# EAGLE schematic badge_2013 (EAGLE 6.4)

## Sheet 1 of 2
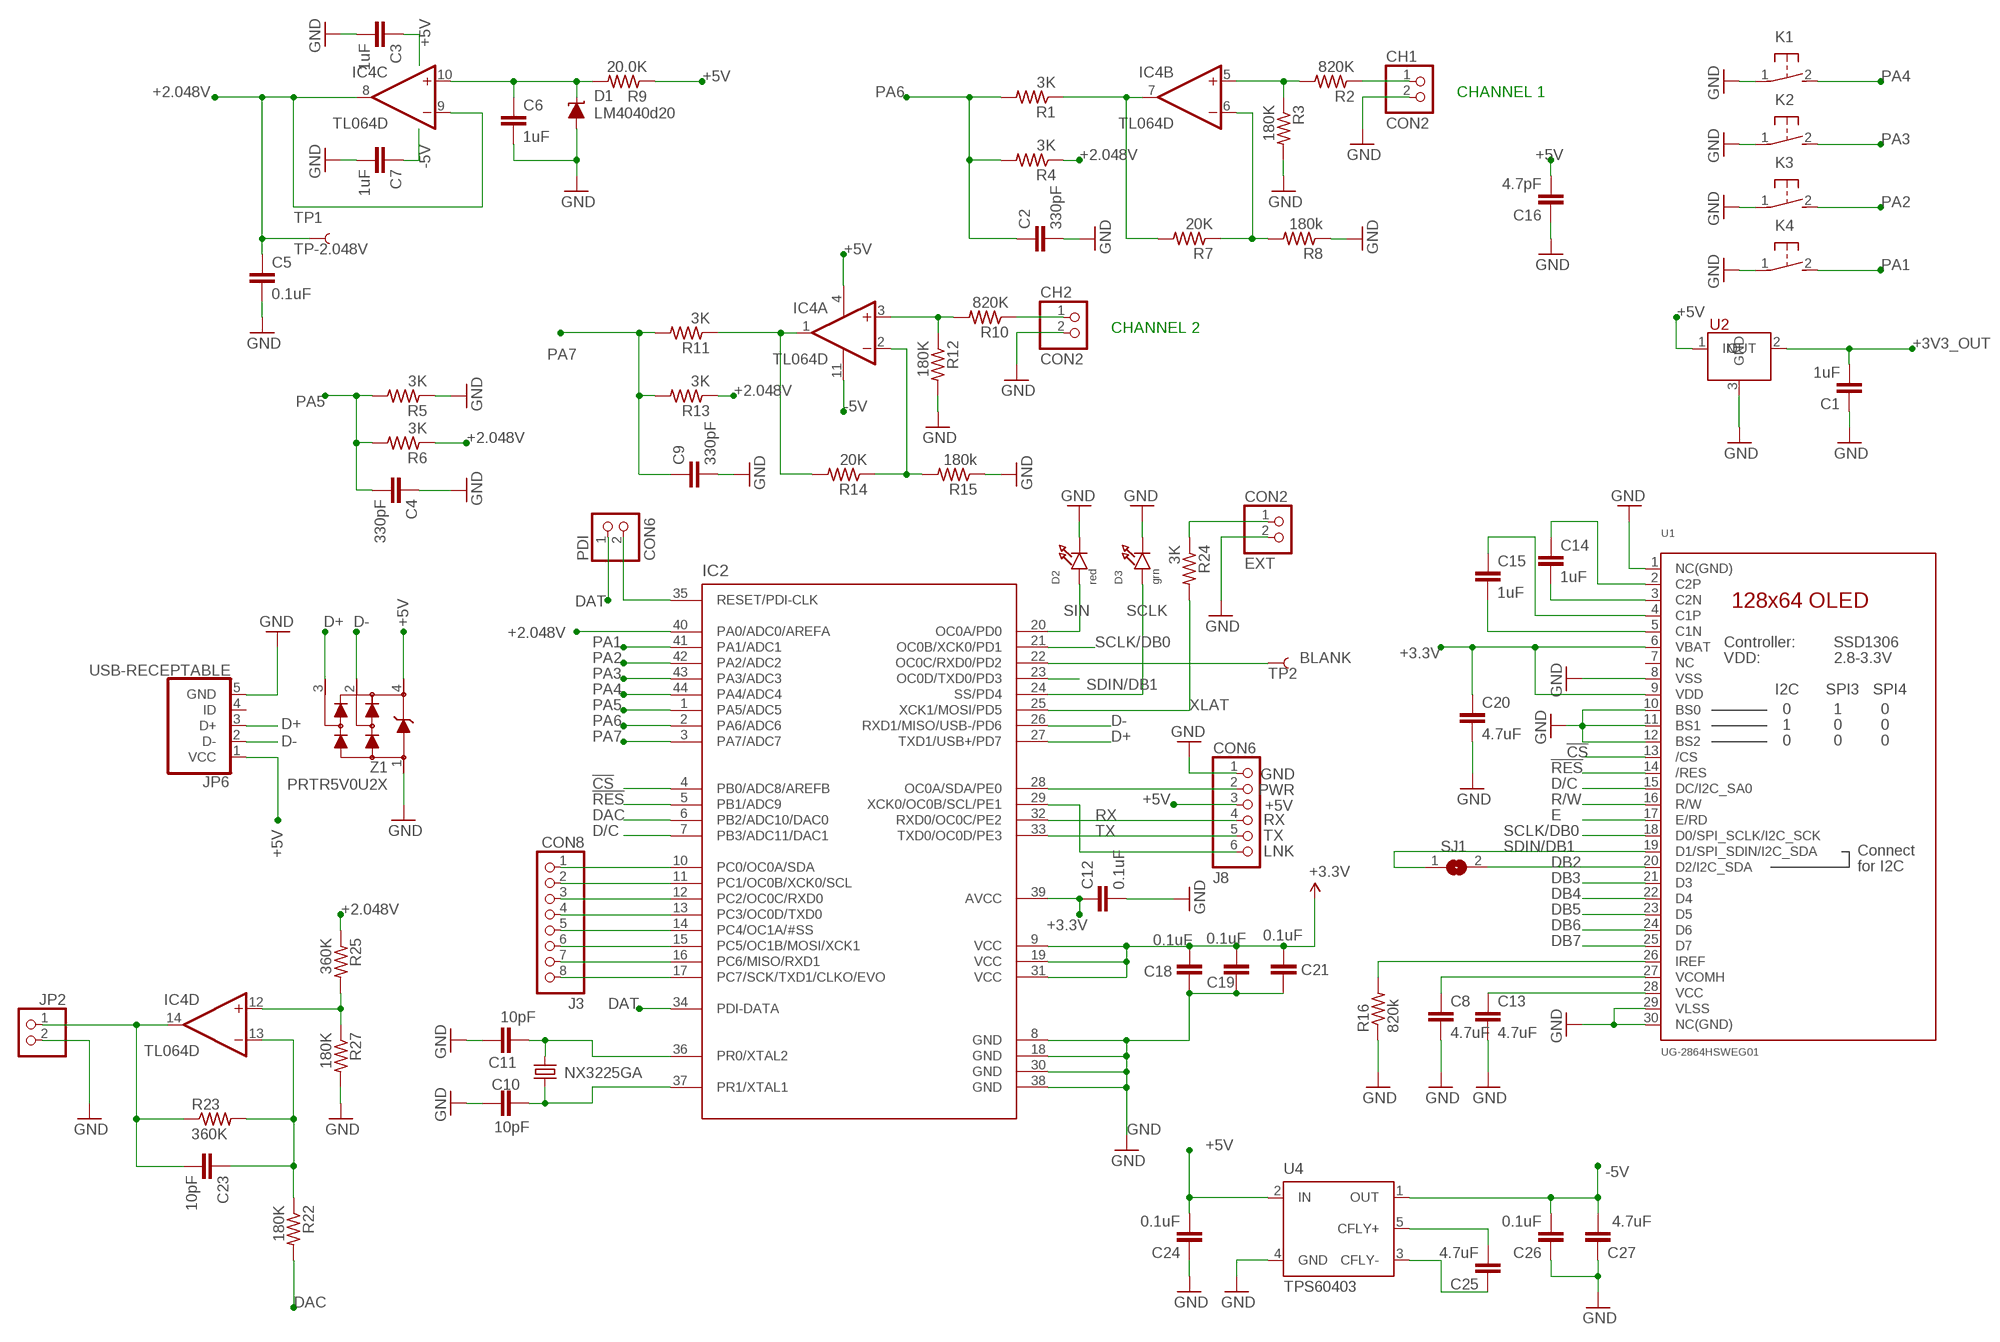
[diagram p0: schematic, sheet 1]

### Parts
C1  1uF  CAP0805  [0805]
C2  330pF  CAP0805  [0805]
C3  1uF  CAP0805  [0805]
C4  330pF  CAP0805  [0805]
C5  0.1uF  CAP0805  [0805]
C6  1uF  CAP0805  [0805]
C7  1uF  CAP0805  [0805]
C8  4.7uF  CAP0805  [0805]
C9  330pF  CAP0805  [0805]
C10  10pF  CAP0805  [0805]
C11  10pF  CAP0805  [0805]
C12  0.1uF  CAP0805  [0805]
C13  4.7uF  CAP0805  [0805]
C14  1uF  CAP0805  [0805]
C15  1uF  CAP0805  [0805]
C16  4.7pF  CAP0805  [0805]
C18  0.1uF  CAP0805  [0805]
C19  0.1uF  CAP0805  [0805]
C20  4.7uF  CAP0805  [0805]
C21  0.1uF  CAP0805  [0805]
C23  10pF  CAP0805  [0805]
C24  0.1uF  CAP0805  [0805]
C25  4.7uF  CAP0805  [0805]
C26  0.1uF  CAP0805  [0805]
C27  4.7uF  CAP0805  [0805]
CH1  CON2  HEADER-1X2  [1X02_OVAL]
CH2  CON2  HEADER-1X2  [1X02_OVAL]
CON2  EXT  HEADER-1X2  [1X02_OVAL]
CON6  J8  HEADER-1X6  [1X06_OVAL]
CON8  J3  HEADER-1X8  [1X08_OVAL]
D1  LM4040d20  LM4041D12DBZ  [DBZ_R-PDSO-G3]
D2  red  LED0805  [CHIPLED_0805]
D3  grn  LED0805  [CHIPLED_0805]
IC2  NONOLITH_ATXMEGAXXA4U-AU  [NONOLITH_TQFP-44]
IC4  TL064D  [SO14]
JP2  HEADER-1X2  [1X02_OVAL]
JP6  USB-RECEPTABLE  [FCI-10103594-0001LF]
K1  5-XX  [B3F-5XX]
K2  5-XX  [B3F-5XX]
K3  5-XX  [B3F-5XX]
K4  5-XX  [B3F-5XX]
PDI  CON6  HEADER-1X2  [1X02_OVAL]
R1  3K  R-US_R0805  [R0805]
R2  820K  R-US_R0805  [R0805]
R3  180K  R-US_R0805  [R0805]
R4  3K  R-US_R0805  [R0805]
R5  3K  R-US_R0805  [R0805]
R6  3K  R-US_R0805  [R0805]
R7  20K  R-US_R0805  [R0805]
R8  180k  R-US_R0805  [R0805]
R9  20.0K  R-US_R0805  [R0805]
R10  820K  R-US_R0805  [R0805]
R11  3K  R-US_R0805  [R0805]
R12  180K  R-US_R0805  [R0805]
R13  3K  R-US_R0805  [R0805]
R14  20K  R-US_R0805  [R0805]
R15  180k  R-US_R0805  [R0805]
R16  820k  R-US_R0805  [R0805]
R22  180K  R-US_R0805  [R0805]
R23  360K  R-US_R0805  [R0805]
R24  3K  R-US_R0805  [R0805]
R25  360K  R-US_R0805  [R0805]
R27  180K  R-US_R0805  [R0805]
SJ1  SOLDERJUMPERREFLOW  [SOLDERJUMPER_REFLOW]
TP1  TP-2.048V  TEST-POINT2  [PAD.02X.02]
TP2  TEST-POINT2  [PAD.02X.02]
U1  UG-2864HSWEG01  MICROBUILDER_DISP_OLED_UG-2864HSWEG010.96"  [MICROBUILDER_UG-2864HSWEG01_0.96IN_WRAPAROUND]
U2  AP7333-33SOT23-3  [SOT23-3]
U4  TPS60403  [SOT-23-5]
X2  NX3225GA  [NX3225GA]
Z1  PRTR5V0U2X  [SOT143B]

### Nets
!CS: IC2.4(PB0/ADC8/AREFB) U1.13(/CS)
!RES: IC2.5(PB1/ADC9) U1.14(/RES)
+2.048V: C5.1 IC2.40(PA0/ADC0/AREFA) IC4.8(C:OUT) IC4.9(C:-IN) R4.1 R6.1 R13.1 R25.1 TP1.P$1
+3.3V: C12.1 C18.2 C19.2 C20.1 C21.2 IC2.9(VCC) IC2.19(VCC) IC2.31(VCC) IC2.39(AVCC) U1.6(VBAT) U1.9(VDD) ; also sheet 2
+3V3_OUT: C1.2 U2.2(OUT) ; also sheet 2
+5V: C3.1 C16.2 C24.2 CON6.3 IC4.4(P:V+) JP6.1(VCC) R9.1 U2.1(IN) U4.2(IN) Z1.4
-5V: C7.1 C26.2 C27.2 IC4.11(P:V-) U4.1(OUT)
BLANK: IC2.22(OC0C/RXD0/PD2) TP2.P$1 ; also sheet 2
D+: IC2.27(TXD1/USB+/PD7) JP6.3(D+) Z1.3
D-: IC2.26(RXD1/MISO/USB-/PD6) JP6.2(D-) Z1.2
D/C: IC2.7(PB3/ADC11/DAC1) U1.15(DC/I2C_SA0)
DAC: IC2.6(PB2/ADC10/DAC0) R22.2
DAT: IC2.34(PDI-DATA) PDI.1
DB2: SJ1.2 U1.20(D2/I2C_SDA)
DB3: U1.21(D3)
DB4: U1.22(D4)
DB5: U1.23(D5)
DB6: U1.24(D6)
DB7: U1.25(D7)
E: U1.17(E/RD)
GND: C1.1 C2.2 C3.2 C4.1 C5.2 C6.2 C7.2 C8.2 C9.2 C10.1 C11.1 C12.2 C13.2 C16.1 C18.1 C19.1 C20.2 C21.1 C24.1 C26.1 C27.1 CH1.2 CH2.2 CON2.2 CON6.1 D1.2(A) D2.C D3.C IC2.8(GND) IC2.18(GND) IC2.30(GND) IC2.38(GND) JP2.2 JP6.5(GND) K1.1(P) K2.1(P) K3.1(P) K4.1(P) R3.2 R5.1 R8.1 R12.2 R15.1 R16.1 R27.2 U1.1(NC(GND)) U1.8(VSS) U1.10(BS0) U1.11(BS1) U1.12(BS2) U1.29(VLSS) U1.30(NC(GND)) U2.3(GND) U4.4(GND) Z1.1 ; also sheet 2
J3: CON8.5 IC2.14(PC4/OC1A/#SS)
LNK: CON6.6 IC2.29(XCK0/OC0B/SCL/PE1)
N$2: C14.1 U1.2(C2P)
N$3: C14.2 U1.3(C2N)
N$4: C15.1 U1.4(C1P)
N$5: C15.2 U1.5(C1N)
N$6: CON2.1 R24.1
N$7: C23.2 IC4.14(D:OUT) JP2.1 R23.1
N$8: C25.2 U4.5(CFLY+)
N$9: C25.1 U4.3(CFLY-)
N$10: CON8.1 IC2.10(PC0/OC0A/SDA)
N$11: CON8.2 IC2.11(PC1/OC0B/XCK0/SCL)
N$12: CON8.3 IC2.12(PC2/OC0C/RXD0)
N$14: CON8.4 IC2.13(PC3/OC0D/TXD0)
N$16: CON8.6 IC2.15(PC5/OC1B/MOSI/XCK1)
N$17: CON8.7 IC2.16(PC6/MISO/RXD1)
N$18: CON8.8 IC2.17(PC7/SCK/TXD1/CLKO/EVO)
N$20: IC4.12(D:+IN) R25.2 R27.1
N$23: C6.1 D1.1(C) IC4.10(C:+IN) R9.2
N$24: C23.1 IC4.13(D:-IN) R22.1 R23.2
N$25: IC4.5(B:+IN) R2.2 R3.1
N$26: CH1.1 R2.1
N$27: IC4.3(A:+IN) R10.2 R12.1
N$28: IC4.6(B:-IN) R7.1 R8.2
N$29: IC4.7(B:OUT) R1.1 R7.2
N$30: CH2.1 R10.1
N$31: IC4.2(A:-IN) R14.1 R15.2
N$32: R16.2 U1.26(IREF)
N$33: C8.1 U1.27(VCOMH)
N$34: C13.1 U1.28(VCC)
N$35: IC4.1(A:OUT) R11.1 R14.2
N$36: C11.2 IC2.36(PR0/XTAL2) X2.3
N$37: C10.2 IC2.37(PR1/XTAL1) X2.1
N$38: IC2.35(RESET/PDI-CLK) PDI.2
PA1: IC2.41(PA1/ADC1) K4.2(S)
PA2: IC2.42(PA2/ADC2) K3.2(S)
PA3: IC2.43(PA3/ADC3) K2.2(S)
PA4: IC2.44(PA4/ADC4) K1.2(S)
PA5: C4.2 IC2.1(PA5/ADC5) R5.2 R6.2
PA6: C2.1 IC2.2(PA6/ADC6) R1.2 R4.2
PA7: C9.1 IC2.3(PA7/ADC7) R11.2 R13.2
PWR: CON6.2 IC2.28(OC0A/SDA/PE0)
R/W: U1.16(R/W)
RX: CON6.4 IC2.32(RXD0/OC0C/PE2)
SCLK: D3.A IC2.24(SS/PD4) ; also sheet 2
SCLK/DB0: IC2.21(OC0B/XCK0/PD1) U1.18(D0/SPI_SCLK/I2C_SCK)
SDIN/DB1: IC2.23(OC0D/TXD0/PD3) SJ1.1 U1.19(D1/SPI_SDIN/I2C_SDA)
SIN: D2.A IC2.20(OC0A/PD0) ; also sheet 2
TX: CON6.5 IC2.33(TXD0/OC0D/PE3)
XLAT: IC2.25(XCK1/MOSI/PD5) R24.2 ; also sheet 2
Unconnected: JP6.4(ID) U1.7(NC)

### Notes on the sheet
- CHANNEL 1
- CHANNEL 2

## Sheet 2 of 2
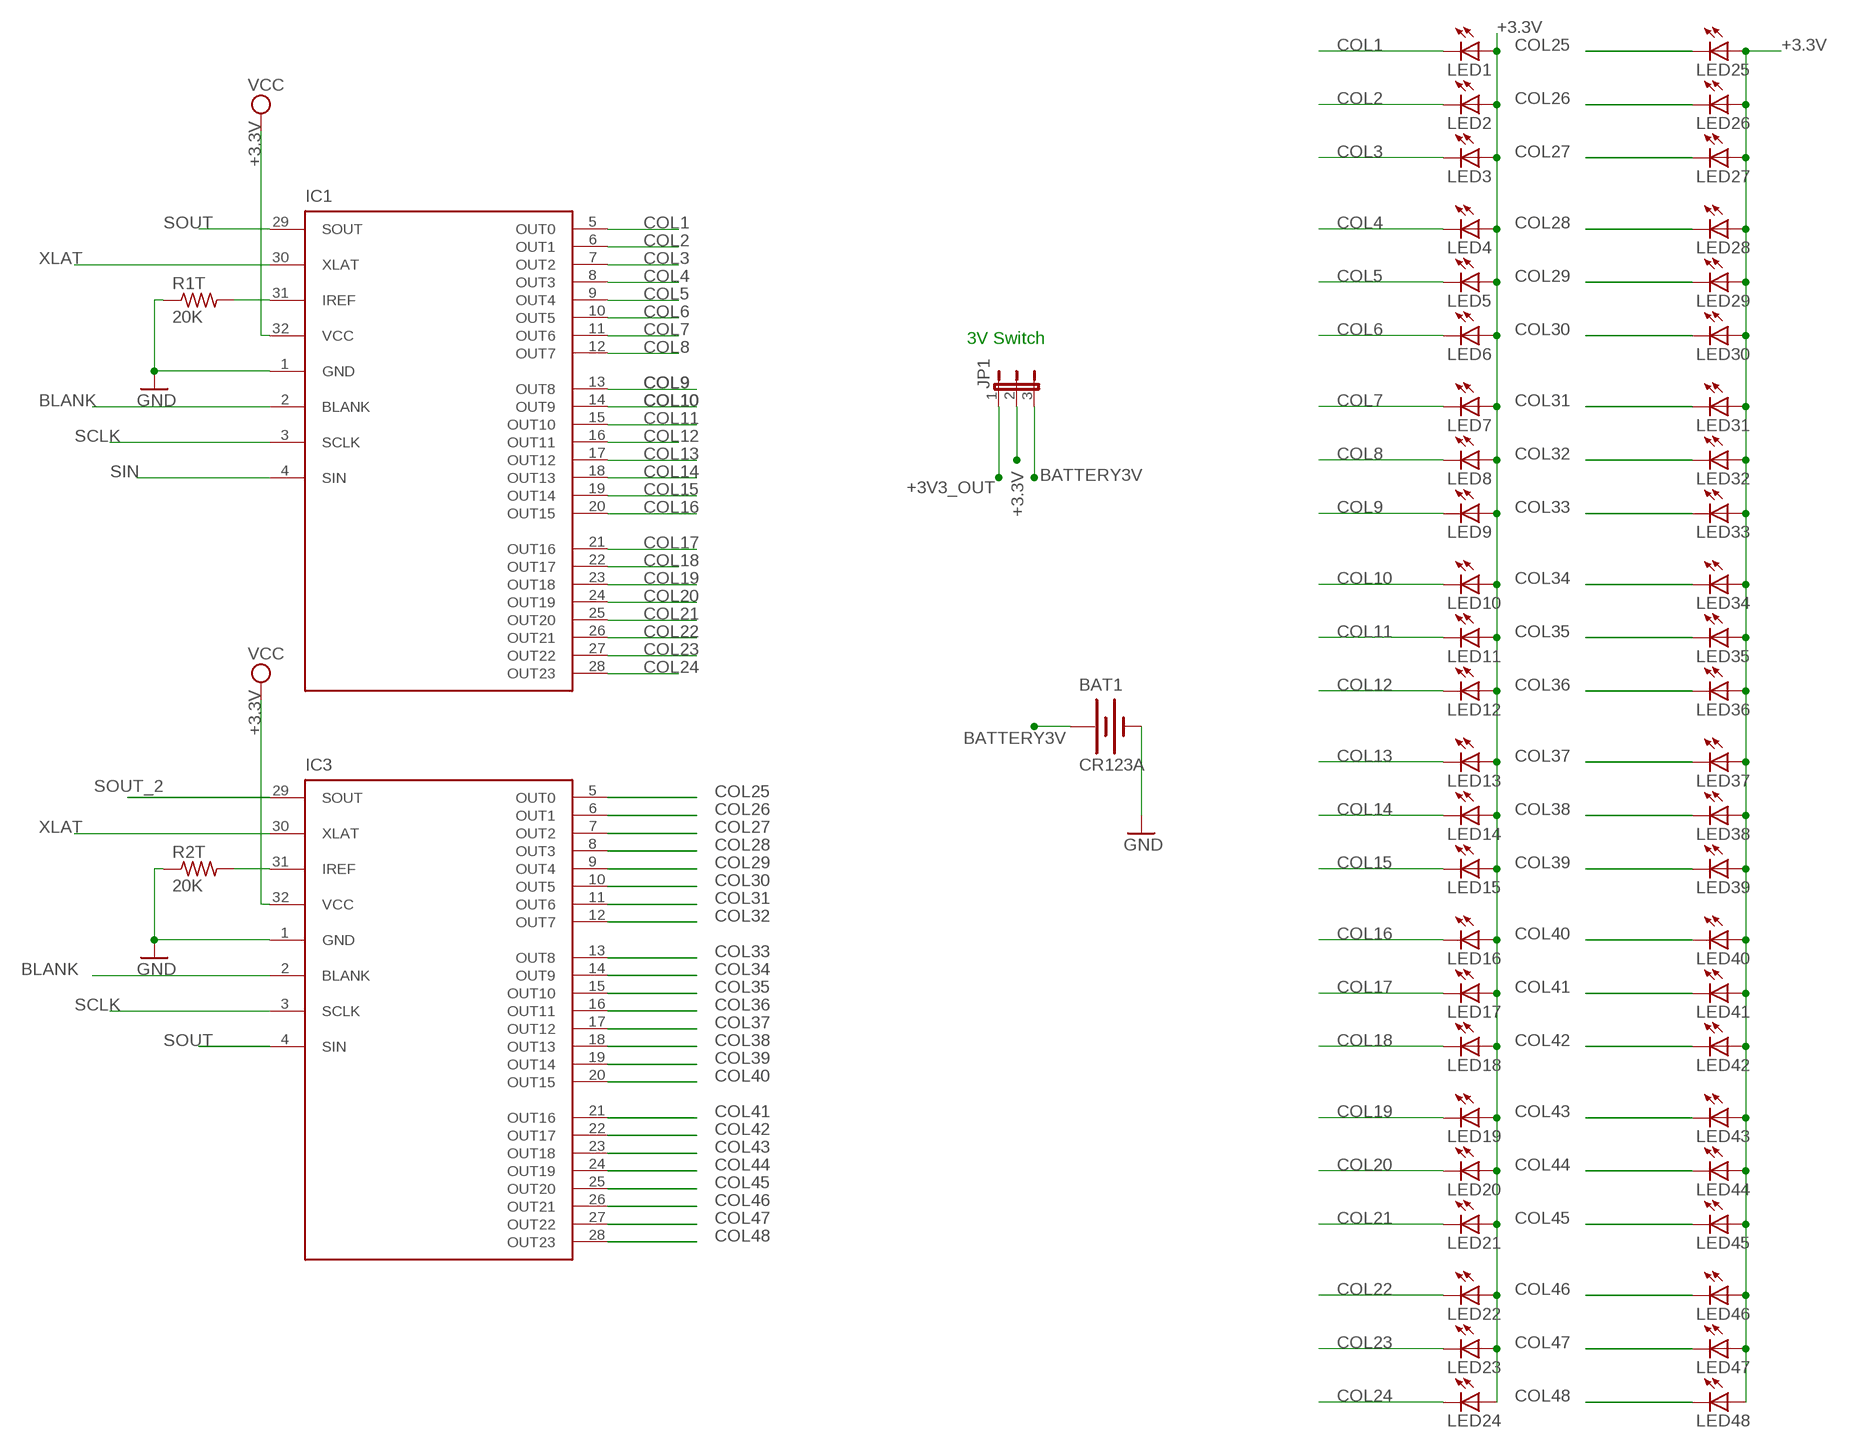
[diagram p1: schematic, sheet 2]

### Parts
BAT1  CR123A  BATTERYCR123A  [BATTERY_CR123A]
IC1  SLICE_NOSHIFT_TLC5947HTSSOP32DAP  [HTSSOP32DAP]
IC3  SLICE_NOSHIFT_TLC5947HTSSOP32DAP  [HTSSOP32DAP]
JP1  JUMPER3  [JUMPER3]
LED1  LED3MM  [LED3MM]
LED2  LED3MM  [LED3MM]
LED3  LED3MM  [LED3MM]
LED4  LED3MM  [LED3MM]
LED5  LED3MM  [LED3MM]
LED6  LED3MM  [LED3MM]
LED7  LED3MM  [LED3MM]
LED8  LED3MM  [LED3MM]
LED9  LED3MM  [LED3MM]
LED10  LED3MM  [LED3MM]
LED11  LED3MM  [LED3MM]
LED12  LED3MM  [LED3MM]
LED13  LED3MM  [LED3MM]
LED14  LED3MM  [LED3MM]
LED15  LED3MM  [LED3MM]
LED16  LED3MM  [LED3MM]
LED17  LED3MM  [LED3MM]
LED18  LED3MM  [LED3MM]
LED19  LED3MM  [LED3MM]
LED20  LED3MM  [LED3MM]
LED21  LED3MM  [LED3MM]
LED22  LED3MM  [LED3MM]
LED23  LED3MM  [LED3MM]
LED24  LED3MM  [LED3MM]
LED25  LED3MM  [LED3MM]
LED26  LED3MM  [LED3MM]
LED27  LED3MM  [LED3MM]
LED28  LED3MM  [LED3MM]
LED29  LED3MM  [LED3MM]
LED30  LED3MM  [LED3MM]
LED31  LED3MM  [LED3MM]
LED32  LED3MM  [LED3MM]
LED33  LED3MM  [LED3MM]
LED34  LED3MM  [LED3MM]
LED35  LED3MM  [LED3MM]
LED36  LED3MM  [LED3MM]
LED37  LED3MM  [LED3MM]
LED38  LED3MM  [LED3MM]
LED39  LED3MM  [LED3MM]
LED40  LED3MM  [LED3MM]
LED41  LED3MM  [LED3MM]
LED42  LED3MM  [LED3MM]
LED43  LED3MM  [LED3MM]
LED44  LED3MM  [LED3MM]
LED45  LED3MM  [LED3MM]
LED46  LED3MM  [LED3MM]
LED47  LED3MM  [LED3MM]
LED48  LED3MM  [LED3MM]
R1T  20K  R-US_R0805  [R0805]
R2T  20K  R-US_R0805  [R0805]

### Nets
+3.3V: IC1.32(VCC) IC3.32(VCC) JP1.2 LED1.A LED2.A LED3.A LED4.A LED5.A LED6.A LED7.A LED8.A LED9.A LED10.A LED11.A LED12.A LED13.A LED14.A LED15.A LED16.A LED17.A LED18.A LED19.A LED20.A LED21.A LED22.A LED23.A LED24.A LED25.A LED26.A LED27.A LED28.A LED29.A LED30.A LED31.A LED32.A LED33.A LED34.A LED35.A LED36.A LED37.A LED38.A LED39.A LED40.A LED41.A LED42.A LED43.A LED44.A LED45.A LED46.A LED47.A LED48.A ; supply symbol labelled VCC ; also sheet 1
+3V3_OUT: JP1.1 ; also sheet 1
BATTERY3V: BAT1.+ JP1.3
BLANK: IC1.2(BLANK) IC3.2(BLANK) ; also sheet 1
COL1: IC1.5(OUT0) LED1.K(C)
COL2: IC1.6(OUT1) LED2.K(C)
COL3: IC1.7(OUT2) LED3.K(C)
COL4: IC1.8(OUT3) LED4.K(C)
COL5: IC1.9(OUT4) LED5.K(C)
COL6: IC1.10(OUT5) LED6.K(C)
COL7: IC1.11(OUT6) LED7.K(C)
COL8: IC1.12(OUT7) LED8.K(C)
COL9: IC1.13(OUT8) LED9.K(C)
COL10: IC1.14(OUT9) LED10.K(C)
COL11: IC1.15(OUT10) LED11.K(C)
COL12: IC1.16(OUT11) LED12.K(C)
COL13: IC1.17(OUT12) LED13.K(C)
COL14: IC1.18(OUT13) LED14.K(C)
COL15: IC1.19(OUT14) LED15.K(C)
COL16: IC1.20(OUT15) LED16.K(C)
COL17: IC1.21(OUT16) LED17.K(C)
COL18: IC1.22(OUT17) LED18.K(C)
COL19: IC1.23(OUT18) LED19.K(C)
COL20: IC1.24(OUT19) LED20.K(C)
COL21: IC1.25(OUT20) LED21.K(C)
COL22: IC1.26(OUT21) LED22.K(C)
COL23: IC1.27(OUT22) LED23.K(C)
COL24: IC1.28(OUT23) LED24.K(C)
COL25: IC3.5(OUT0) LED25.K(C)
COL26: IC3.6(OUT1) LED26.K(C)
COL27: IC3.7(OUT2) LED27.K(C)
COL28: IC3.8(OUT3) LED28.K(C)
COL29: IC3.9(OUT4) LED29.K(C)
COL30: IC3.10(OUT5) LED30.K(C)
COL31: IC3.11(OUT6) LED31.K(C)
COL32: IC3.12(OUT7) LED32.K(C)
COL33: IC3.13(OUT8) LED33.K(C)
COL34: IC3.14(OUT9) LED34.K(C)
COL35: IC3.15(OUT10) LED35.K(C)
COL36: IC3.16(OUT11) LED36.K(C)
COL37: IC3.17(OUT12) LED37.K(C)
COL38: IC3.18(OUT13) LED38.K(C)
COL39: IC3.19(OUT14) LED39.K(C)
COL40: IC3.20(OUT15) LED40.K(C)
COL41: IC3.21(OUT16) LED41.K(C)
COL42: IC3.22(OUT17) LED42.K(C)
COL43: IC3.23(OUT18) LED43.K(C)
COL44: IC3.24(OUT19) LED44.K(C)
COL45: IC3.25(OUT20) LED45.K(C)
COL46: IC3.26(OUT21) LED46.K(C)
COL47: IC3.27(OUT22) LED47.K(C)
COL48: IC3.28(OUT23) LED48.K(C)
GND: BAT1.- IC1.1(GND) IC3.1(GND) R1T.1 R2T.1 ; also sheet 1
N$1: IC3.31(IREF) R2T.2
N$13: IC1.31(IREF) R1T.2
SCLK: IC1.3(SCLK) IC3.3(SCLK) ; also sheet 1
SIN: IC1.4(SIN) ; also sheet 1
SOUT: IC1.29(SOUT) IC3.4(SIN)
SOUT_2: IC3.29(SOUT)
XLAT: IC1.30(XLAT) IC3.30(XLAT) ; also sheet 1

### Notes on the sheet
- 3V Switch

## Power pins joined to a net without a drawn wire
DGND: X2.2(DGND) X2.4(DGND)

## Library data of the parts
BAT1 = tvbgone-adj:BATTERY: Battery Holders Various common sizes : AA, AAA, 20mm coin cell and 12mm coin cell.
C1-C16 C18-C21 C23-C27 = SparkFun:CAP: Capacitor Standard 0603 ceramic capacitor, and 0.1" leaded capacitor.
CH1 CH2 CON2 JP2 PDI = microbuilder:HEADER-1X2: PIN HEADER
CON6 = microbuilder:HEADER-1X6: PIN HEADER
CON8 = microbuilder:HEADER-1X8: PIN HEADER
D1 = texas:LM4041: PRECISION MICROPOWER SHUNT VOLTAGE REFERENCE Source: http://focus.ti.com/lit/ds/slcs146e/slcs146e.pdf; MF: TEXAS INSTRUMENT CONNECTORS; MPN: LM4041D12QDBZT; OC_FARNELL: 1755118; OC_NEWARK: 43K3381
D2 D3 = microbuilder:LED: LED
IC1 IC3 = 23b_clock_noleds:SLICE_NOSHIFT_TLC5947
IC2 = Outline:NONOLITH_ATXMEGAXXA4U: ATXMEGA A4U Series (XMEGA+USB)
IC4 = linear:TL064: OP AMP
JP1 = microbuilder:JUMPER3: JUMPER - 3 Pins
JP6 = daspilker:USB-RECEPTABLE: USB Receptable
K1-K4 = switch-omron:5-XX
LED1-LED48 = led:LED: LED
R1-R16 R22-R25 R27 = resistor:R-US_: RESISTOR, American symbol
R1T R2T = rcl:R-US_: RESISTOR, American symbol
SJ1 = microbuilder:SOLDERJUMPER: SMD Solder JUMPER Solder the two pads together to create a connection, or remove the solder to break it. REFLOW - Use this footprint for solder paste and reflow ovens. WAVE - Use this footprint for hand-soldering (larger pads).
TP1 TP2 = SparkFun:TEST-POINT
U1 = badge.lbrbadge_2013:MICROBUILDER_DISP_OLED_UG-2864HSWEG01: UG-2864HSWEG01 OLED display Both 1.3" and 0.96" models share the same FPC tab footprint, only the screen dimensions vary.
U2 = SparkFun:AP7333-33: AP7333-33 300mA, Low Quiescent Current, Fast Transient Low Dropout Linear Regulator
U4 = RHD2000_eval_board:TPS60403: Texas Instruments TPS60403 voltage inverter
X2 = M6-RF315:NX3225GA: NX3225GA Crystal oscillator NDK NX3225GA small surface-mount type crystal unit in compact and thin 3.2 x 2.5 x 0.75 mm package. Source: http://www.ndk.com/images/products/catalog/c_NX3225GA-STD-CRG-1_e.pdf
Z1 = USBug:PRTR5V0U2X: Ultra low capacitance double rail-to-rail ESD protection diode